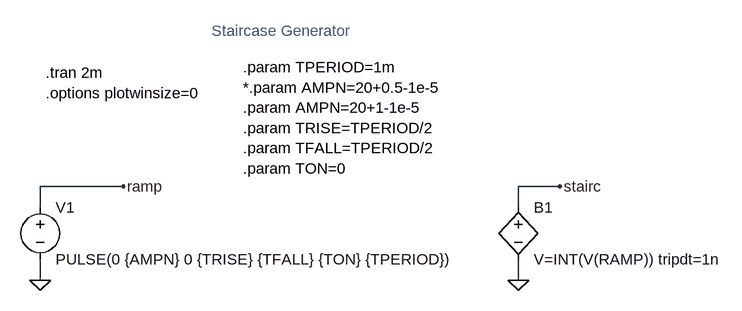
[diagram p0: schematic Staircase.asc]
Staircase.asc, the LTspice schematic file:
Version 4
SHEET 1 1136 680
WIRE 176 176 48 176
WIRE 848 176 784 176
WIRE 48 208 48 176
WIRE 784 208 784 176
WIRE 48 320 48 288
WIRE 784 320 784 288
FLAG 48 320 0
FLAG 784 320 0
FLAG 176 176 ramp
FLAG 848 176 stairc
SYMBOL voltage 48 192 R0
WINDOW 123 0 0 Left 0
WINDOW 39 0 0 Left 0
SYMATTR InstName V1
SYMATTR Value PULSE(0 {AMPN} 0 {TRISE} {TFALL} {TON} {TPERIOD})
SYMBOL bv 784 192 R0
SYMATTR InstName B1
SYMATTR Value V=INT(V(RAMP)) tripdt=1n
TEXT 360 -8 Left 0 !.param TPERIOD=1m\n*.param AMPN=20+0.5-1e-5\n.param AMPN=20+1-1e-5\n.param TRISE=TPERIOD/2\n.param TFALL=TPERIOD/2\n.param TON=0
TEXT 56 0 Left 0 !.tran 2m
TEXT 312 -64 Left 0 ;Staircase Generator
TEXT 56 32 Left 0 !.options plotwinsize=0

The netlist it stands for:
* Staircase.asc
V1 ramp 0 PULSE(0 {AMPN} 0 {TRISE} {TFALL} {TON} {TPERIOD})
B1 stairc 0 V=INT(V(RAMP)) tripdt=1n
.param TPERIOD=1m
*.param AMPN=20+0.5-1e-5
.param AMPN=20+1-1e-5
.param TRISE=TPERIOD/2
.param TFALL=TPERIOD/2
.param TON=0
.tran 2m
* Staircase Generator
.options plotwinsize=0
.backanno
.end